# EAGLE schematic PCB_ERC_-_Coil_DC_to_AC_v0 (EAGLE 9.7.0)
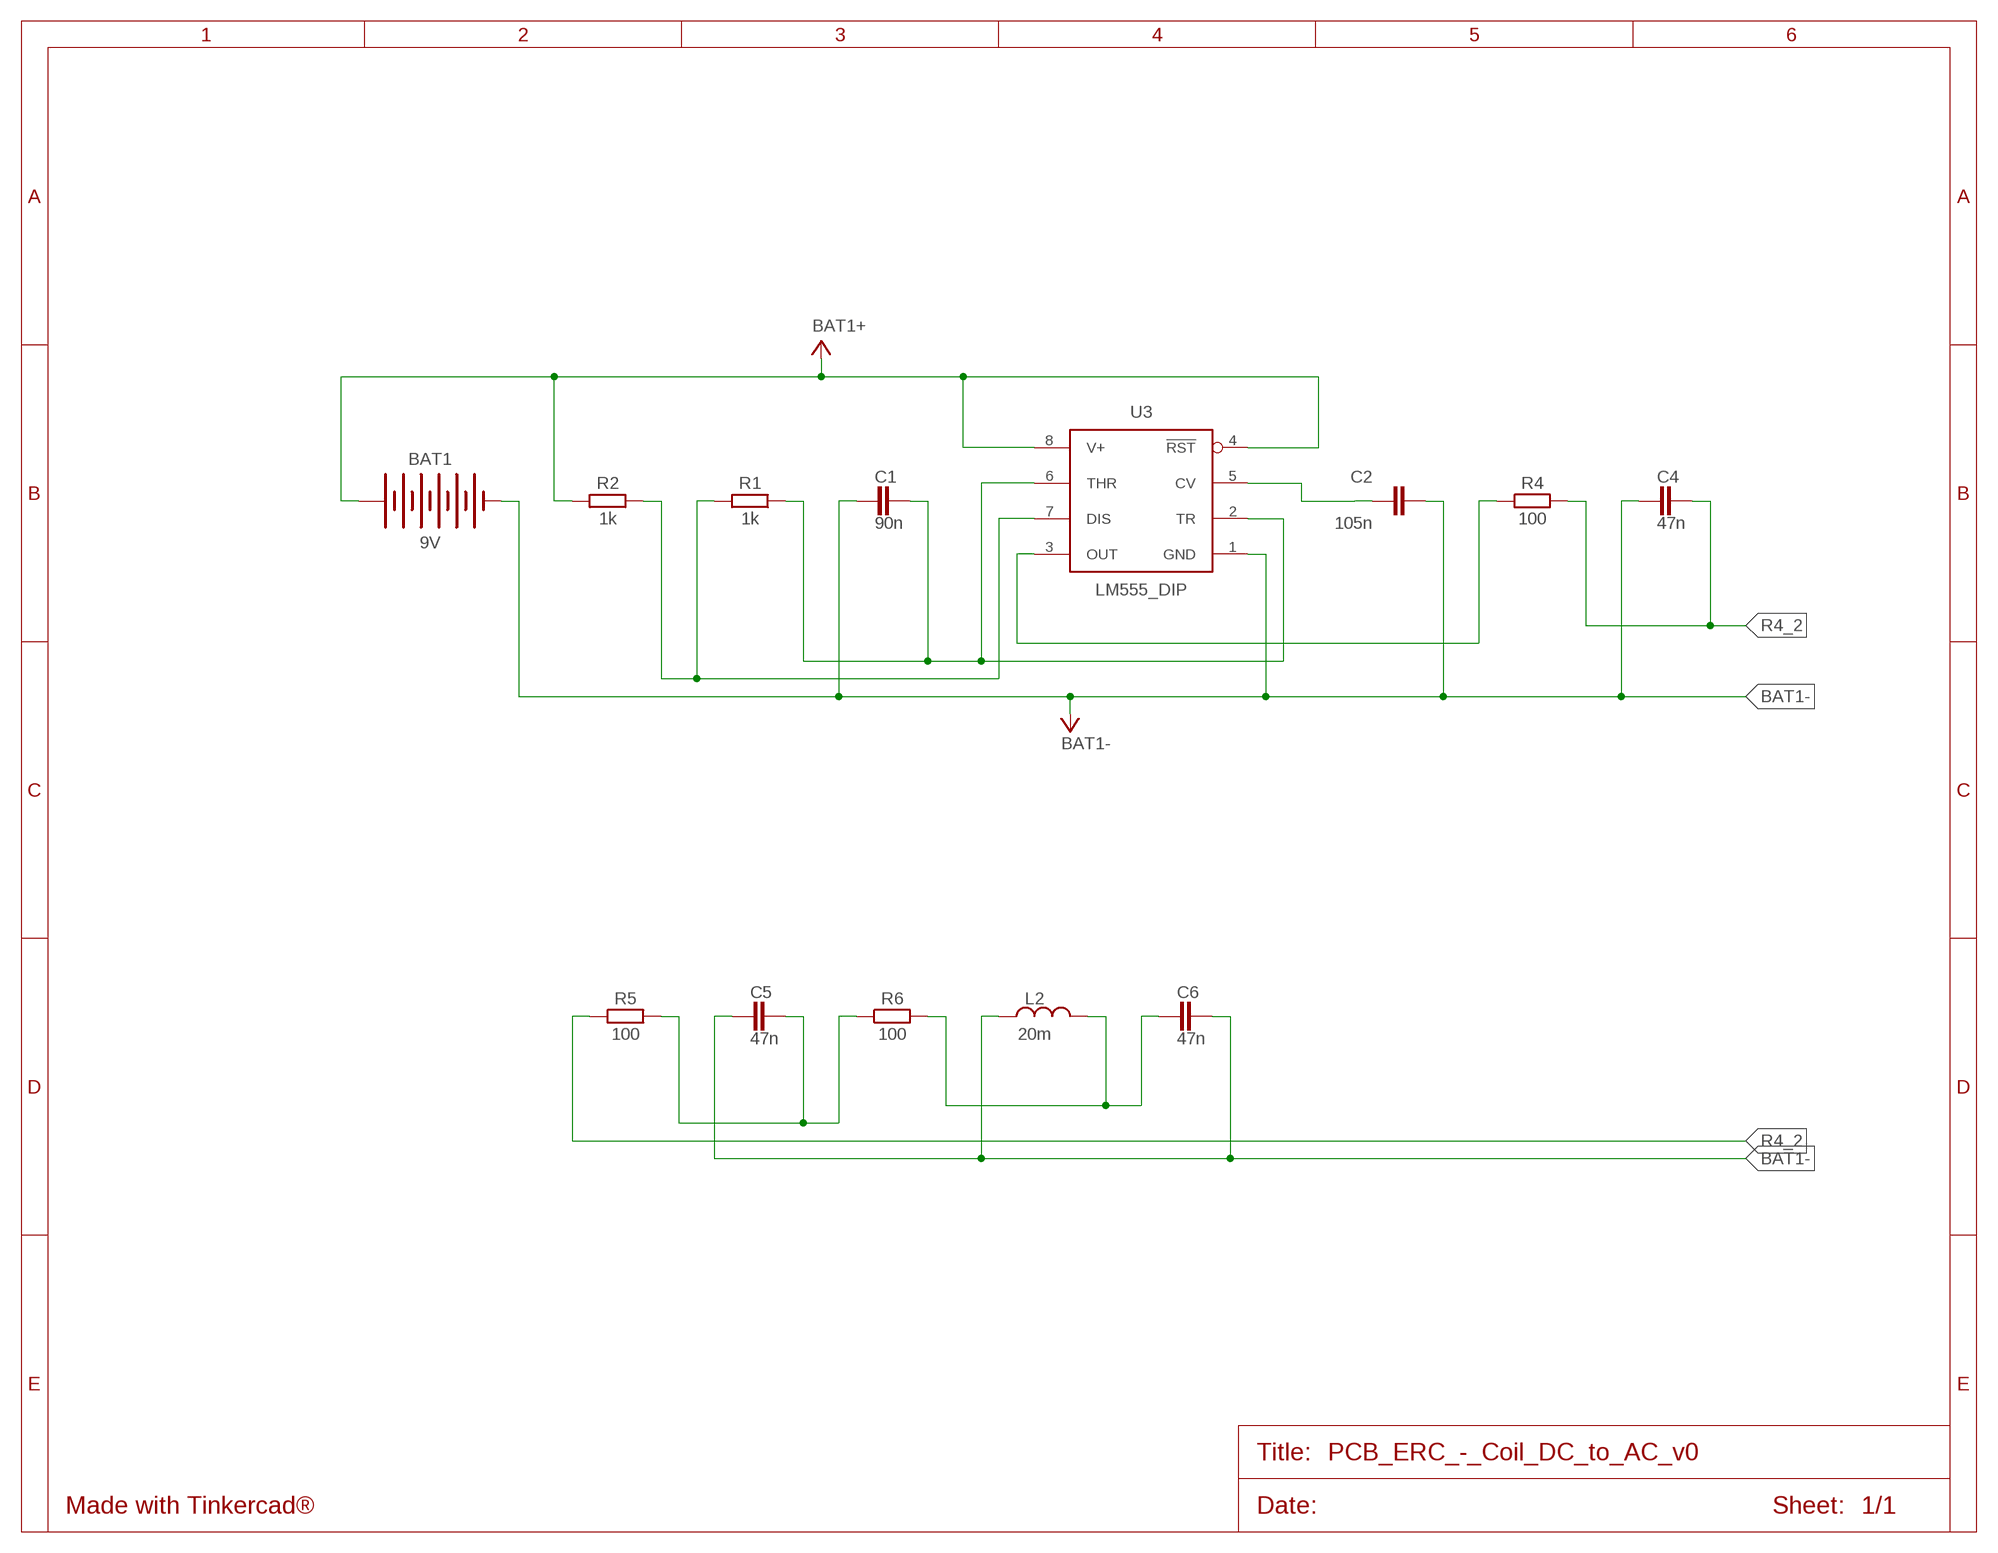
[diagram p0: schematic, sheet 1]

## Parts
BAT1  9V  BATTERY-9VGENERIC  [BATTERY-GENERIC]
C1  90n  CAPACITORCERAMIC-2.54MM  [CAP-THRU-2.54MM]
C2  105n  CAPACITORCERAMIC-2.54MM  [CAP-THRU-2.54MM]
C4  47n  CAPACITORCERAMIC-2.54MM  [CAP-THRU-2.54MM]
C5  47n  CAPACITORCERAMIC-2.54MM  [CAP-THRU-2.54MM]
C6  47n  CAPACITORCERAMIC-2.54MM  [CAP-THRU-2.54MM]
L2  20m  INDUCTOR_RADIAL-26MM-DIA  [INDRD2743W50D3810H2616B]
R1  1k  RESISTOR_AXIAL-10.16MM-PITCH  [RESAD1016W63L850D250B]
R2  1k  RESISTOR_AXIAL-10.16MM-PITCH  [RESAD1016W63L850D250B]
R4  100  RESISTOR_AXIAL-10.16MM-PITCH  [RESAD1016W63L850D250B]
R5  100  RESISTOR_AXIAL-10.16MM-PITCH  [RESAD1016W63L850D250B]
R6  100  RESISTOR_AXIAL-10.16MM-PITCH  [RESAD1016W63L850D250B]
U3  LM555_DIP  [DIP826W53P254L959H508Q8B]

## Nets
BAT1+: BAT1.+ R2.2 U3.4(!RST) U3.8(V+)
BAT1-: BAT1.- C1.2 C2.2 C4.2 C5.2 C6.1 L2.1 U3.1(GND)
R4_2: C4.1 R4.2 R5.1
R5_2: C5.1 R5.2 R6.1
R6_2: C6.2 L2.2 R6.2
U3_CV: C2.1 U3.5(CV)
U3_DIS: R1.2 R2.1 U3.7(DIS)
U3_OUT: R4.1 U3.3(OUT)
U3_THR: C1.1 R1.1 U3.2(TR) U3.6(THR)

## Library data of the parts
BAT1 = Tinkercad:BATTERY-9V
C1 C2 C4-C6 = Tinkercad:CAPACITOR: Capacitor - Generic
L2 = Tinkercad:INDUCTOR: Inductor Fixed - Generic; CATEGORY: Inductor; SUB-CATEGORY: Fixed
R1 R2 R4-R6 = Tinkercad:RESISTOR: Resistor Fixed - Generic
U3 = Tinkercad:*555: TIMER 555 General purpose precision timers NE555 : Texas Datasheet <http://www.ti.com/general/docs/suppproductinfo.tsp?distId=10&gotoUrl=http%3A%2F%2Fwww.ti.com%2Flit%2Fgpn%2Fne555>, Diodes Incorporated Datasheet <https://www.diodes.com/assets/Datasheets/NE555_SA555_NA555.pdf> LM555 Datasheet <http://www.ti.com/general/docs/suppproductinfo.tsp?distId=10&gotoUrl=http%3A%2F%2Fwww.ti.com%2Flit%2Fgpn%2Flm555> LMC555 Datasheet <http://www.ti.com/general/docs/suppproductinfo.tsp?distId=10&gotoUrl=http%3A%2F%2Fwww.ti.com%2Flit%2Fgpn%2Flmc555> ICM7555 : Maxim Integrated Datasheet <https://datasheets.maximintegrated.com/en/ds/ICM7555-ICM7556.pdf>, Renesas Electronics America Inc Datasheet <https://www.renesas.com/en-us/www/doc/datasheet/icm7555-56.pdf>; CATEGORY: IC_Clock-Timing; CURRENT-SUPPLY: 10mA; DESCRIPTION: IC OSC SINGLE TIMER 100KHZ 8-DIP; FREQUENCY: 100kHz; MANUFACTURER: Texas Instruments; MPN: LM555CN/NOPB; OPERATING_TEMP: 0°C to 70°C; PART_STATUS: Active; ROHS_COMPLIANT: ROHS3 Compliant; SUB-CATEGORY: Timer